# Altium schematic sheet 2_Power_Switch.SchDoc: Apalis Evaluation Board 1.1
size A3; Organization: Toradex AG; Address1: Altsagenstrasse 5; Address2: Horw; Address3: 6048; Address4: Switzerland; DocumentNumber: 4; Revision: V1.1; SheetNumber: 4; SheetTotal: 32; PageSetup: Record=PageOptions|CenterHorizontal=True|CenterVertical=True|PrintScale=0.73|XCorrection=1.00|YCorrection=1.00|PrintKind=0|BorderSize=5000000|LeftOffset=0|BottomOffset=0|Orientation=2|PaperLength=1000|PaperWidth=1000|Scale=100|PaperSource=7|PrintQuality=-4|MediaType=1|DitherType=10|PaperKind=A4|PrintScaleMode=1
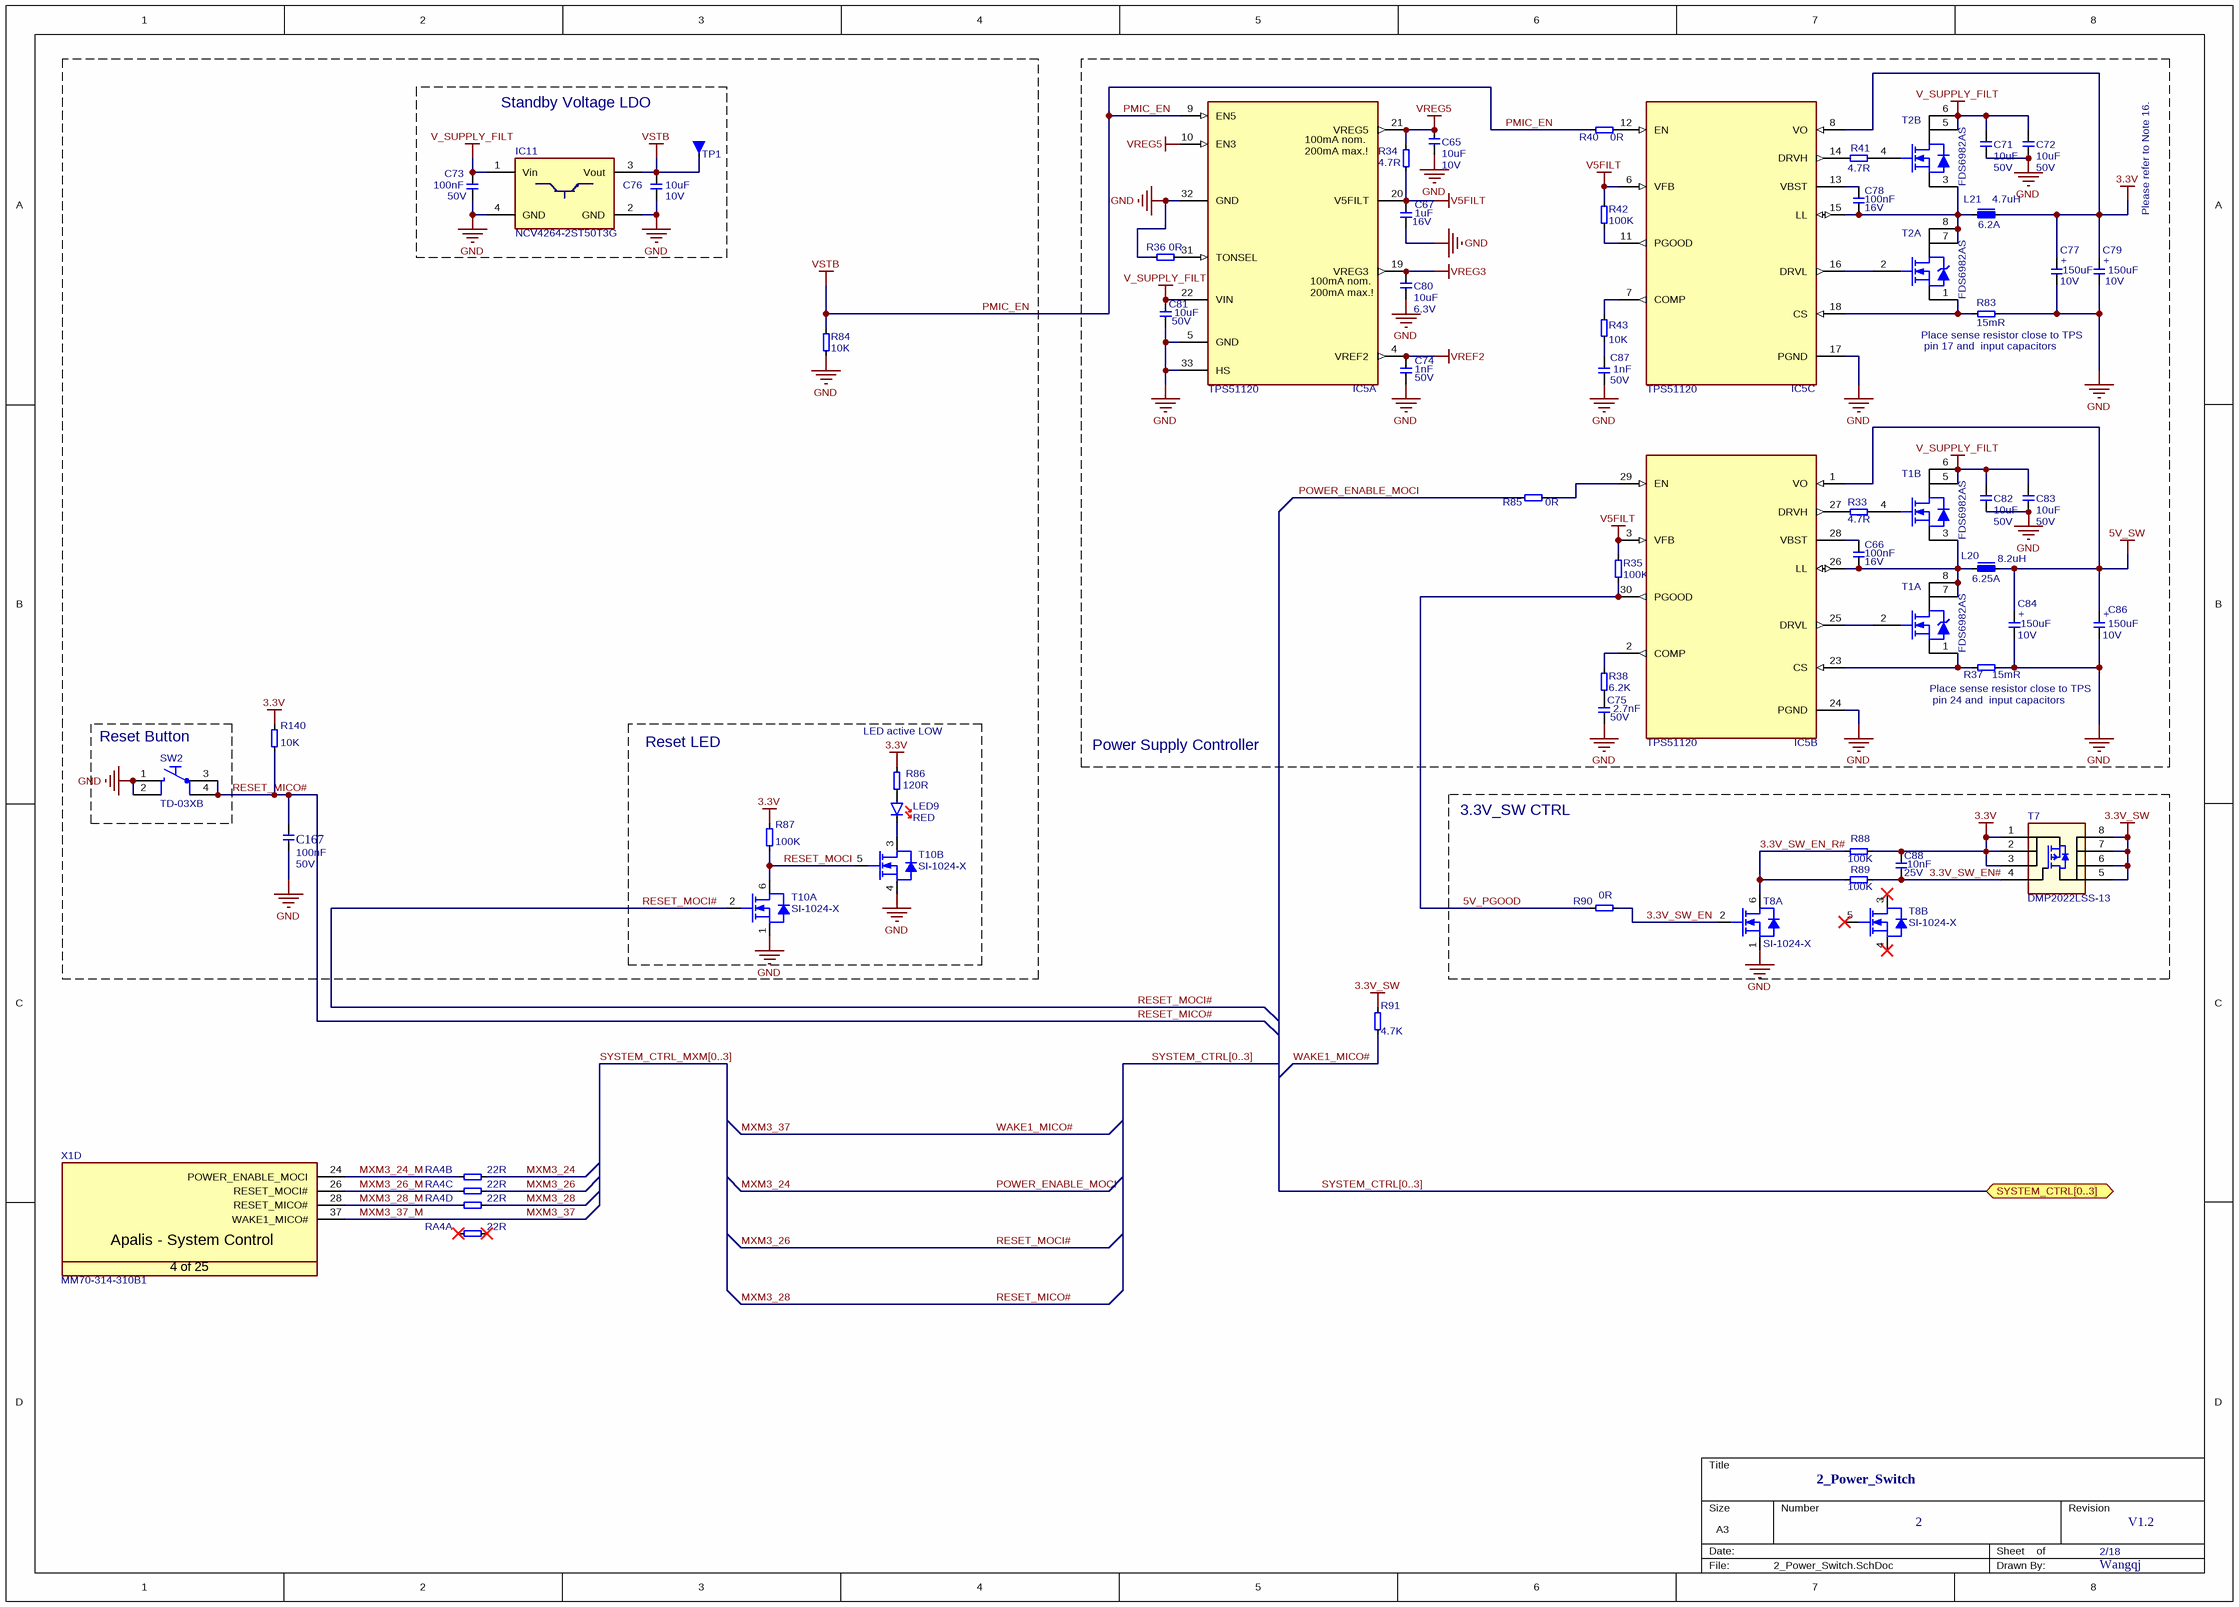
[diagram p0: 2_Power_Switch.SchDoc]

## Parts
C65  Rating: 10V  [T_CAPC0805X125N]  (hidden comment: 10uF)
C66  Rating: 16V  [T_CAPC0603X33N]  (hidden comment: 100nF)
C67  Rating: 16V  [T_CAPC0603X33N]  (hidden comment: 1uF)
C71  Rating: 50V  [CAPC3225X160N]  (hidden comment: 10uF)
C72  Rating: 50V  [CAPC3225X160N]  (hidden comment: 10uF)
C73  Rating: 50V  [T_CAPC0603X33N]  (hidden comment: 100nF)
C74  Rating: 50V  [T_CAPC0603X33N]  (hidden comment: 1nF)
C75  Rating: 50V  [CAPC1005X60N]  (hidden comment: 2.7nF)
C76  Rating: 10V  [T_CAPC0805X125N]  (hidden comment: 10uF)
C77  Rating: 10V  [CAPMP7343X310N]  (hidden comment: 150uF)
C78  Rating: 16V  [T_CAPC0603X33N]  (hidden comment: 100nF)
C79  Rating: 10V  [CAPMP7343X310N]  (hidden comment: 150uF)
C80  Rating: 6.3V  [T_CAPC0603X33N]  (hidden comment: 10uF)
C81  Rating: 50V  [CAPC3225X160N]  (hidden comment: 10uF)
C82  Rating: 50V  [CAPC3225X160N]  (hidden comment: 10uF)
C83  Rating: 50V  [CAPC3225X160N]  (hidden comment: 10uF)
C84  Rating: 10V  [CAPMP7343X310N]  (hidden comment: 150uF)
C86  Rating: 10V  [CAPMP7343X310N]  (hidden comment: 150uF)
C87  Rating: 50V  [T_CAPC0603X33N]  (hidden comment: 1nF)
C88  Rating: 25V  [T_CAPC0603X33N]  (hidden comment: 10nF)
C167  Rating: 50V  [T_CAPC0603X33N]  (hidden comment: 100nF)
IC5  TPS51120  [QFN50P500X500X100-33N]  (parts A,B,C of 3)
IC11  NCV4264-2ST50T3G  [T_ON_NCV4264-2ST50T3G]
L20  Rating: 6.25A  [T_INDM120120X80N]  (hidden comment: 8.2uH)
L21  Rating: 6.2A  [T_INDM102102X45N]  (hidden comment: 4.7uH)
LED9  Color: RED  [LC-0805_LED_S3]  (hidden comment: LS T670-K1L2-1)
R33  4.7R  [RESC1005X40N]
R34  4.7R  [RESC1005X40N]
R35  100K  [T_RESC0603X30N]
R36  0R  [T_RESC0603X30N]
R37  15mR  [RESC3316X76N]
R38  6.2K  [RESC1005X40N]
R40  0R  [T_RESC0603X30N]
R41  4.7R  [RESC1005X40N]
R42  100K  [T_RESC0603X30N]
R43  10K  [T_RESC0603X30N]
R83  15mR  [RESC3316X76N]
R84  10K  [T_RESC0603X30N]
R85  0R  [T_RESC0603X30N]
R86  120R  [T_RESC0603X30N]
R87  100K  [T_RESC0603X30N]
R88  100K  [T_RESC0603X30N]
R89  100K  [T_RESC0603X30N]
R90  0R  [T_RESC0603X30N]
R91  4.7K  [t_RESC0603X30N]
R140  10K  [0805R]
RA4  22R  [T_Resistor_Array_X4]  (parts A,B,C,D of 4)
SW2  TD-03XB  [T_WMF_TD-03XB]
T1  FDS6982AS  [SOIC127P600X173-8N]  (parts A,B of 2)
T2  FDS6982AS  [SOIC127P600X173-8N]  (parts A,B of 2)
T7  DMP2022LSS-13  [SOIC127P600X173-8N]
T8  Manufacturer Part No.: SI-1024-X  [SOTFL50P160X60-6N]  (hidden comment: T-Vishay-SI-1024X-N)  (parts A,B of 2)
T10  Manufacturer Part No.: SI-1024-X  [SOTFL50P160X60-6N]  (hidden comment: T-Vishay-SI-1024X-N)  (parts A,B of 2)
TP1  Testpin  [T_TP-THT]  (value not drawn)
X1  Manufacturer Part No.: MM70-314-310B1  [T_JAE_MM70-314-310B1]  (hidden comment: CON-JAE-MM70-314-310B1-314-0.5mm)  (part D of 25)

## Blocks framed on the sheet
LED active LOW: C167 R84 R140
Power Supply Controller: C65-C67 C71 C72 C74 C75 C77-C84 C86 C87 IC5 L20 L21 R33-R38 R40-R43 R83 R85 T1 T2
Standby Voltage LDO: C73 C76 IC11 TP1
Reset Button: SW2
Reset LED: LED9 R86 R87 T10
3.3V_SW CTRL: C88 R88-R90 T7 T8

## Ports
SYSTEM_CTRL[0..3] (bidir)

## Nets
3.3V: C77.1 C79.1 C88.2 IC5.8(VO) L21.2 R86.2 R87.2 R88.1 R140.2 T7.1(S) T7.2(S) T7.3(S)
3.3V_SW: R91.1 T7.5(D) T7.6(D) T7.7(D) T7.8(D)
5V_SW: C84.1 C86.1 IC5.1(VO) L20.2
GND: C65.1 C67.1 C71.1 C72.1 C73.1 C74.1 C75.1 C76.1 C77.2 C79.2 C80.1 C81.1 C82.1 C83.1 C84.2 C86.2 C87.1 C167.1 IC5.5(GND) IC5.17(PGND) IC5.24(PGND) IC5.32(GND) IC5.33(HS) IC11.2(GND) IC11.4(GND) R36.1 R37.2 R83.2 R84.1 SW2.1 SW2.2 T8.1(S) T10.1(S) T10.4(S)
PMIC_EN: C76.2 IC5.9(EN5) IC11.3(Vout) R40.1 R84.2 TP1.1  [also labelled VSTB]
V5FILT: C67.2 IC5.3(VFB) IC5.6(VFB) IC5.20(V5FILT) R34.1 R35.2 R42.2
V_SUPPLY_FILT: C71.2 C72.2 C73.2 C81.2 C82.2 C83.2 IC5.22(VIN) IC11.1(Vin) T1.5(D) T1.6(D) T2.5(D) T2.6(D)
VREF2: C74.2 IC5.4(VREF2)
VREG3: C80.2 IC5.19(VREG3)
VREG5: C65.2 IC5.10(EN3) IC5.21(VREG5) R34.2
3.3V_SW_EN: R90.1 T8.2(G)
3.3V_SW_EN#: C88.1 R89.1 T7.4(G)
3.3V_SW_EN_R#: R88.2 R89.2 T8.6(D)
5V_PGOOD: IC5.30(PGOOD) R35.1 R90.2
MXM3_24: R85.1 RA4.6  [also labelled POWER_ENABLE_MOCI]
MXM3_24_M: RA4.2 X1.24(POWER_ENABLE_MOCI)
MXM3_26: RA4.7 T10.2(G)  [also labelled RESET_MOCI#]
MXM3_26_M: RA4.3 X1.26(RESET_MOCI#)
MXM3_28: C167.2 R140.1 RA4.8 SW2.3 SW2.4  [also labelled RESET_MICO#]
MXM3_28_M: RA4.4 X1.28(RESET_MICO#)
MXM3_37: R91.2 X1.37(WAKE1_MICO#)  [also labelled MXM3_37_M, WAKE1_MICO#]
RESET_MOCI: R87.1 T10.5(G) T10.6(D)
NetC66_1: C66.1 IC5.26(LL) L20.1 T1.3(S) T1.7(D) T1.8(D)
NetC66_2: C66.2 IC5.28(VBST)
NetC75_2: C75.2 R38.1
NetC78_1: C78.1 IC5.15(LL) L21.1 T2.3(S) T2.7(D) T2.8(D)
NetC78_2: C78.2 IC5.13(VBST)
NetC87_2: C87.2 R43.1
NetIC5_2: IC5.2(COMP) R38.2
NetIC5_7: IC5.7(COMP) R43.2
NetIC5_11: IC5.11(PGOOD) R42.1
NetIC5_12: IC5.12(EN) R40.2
NetIC5_14: IC5.14(DRVH) R41.1
NetIC5_16: IC5.16(DRVL) T2.2(G)
NetIC5_18: IC5.18(CS) R83.1 T2.1(S)
NetIC5_23: IC5.23(CS) R37.1 T1.1(S)
NetIC5_25: IC5.25(DRVL) T1.2(G)
NetIC5_27: IC5.27(DRVH) R33.1
NetIC5_29: IC5.29(EN) R85.2
NetIC5_31: IC5.31(TONSEL) R36.2
NetLED9_A: LED9.A R86.1
NetLED9_K: LED9.K T10.3(D)
NetR33_2: R33.2 T1.4(G)
NetR41_2: R41.2 T2.4(G)

Not connected (* = marked no-connect by the designer): RA4 1* 5*; T8 3(D)* 4(S)* 5(G)*

## Buses and harness runs
bus SYSTEM_CTRL[0..3] = port SYSTEM_CTRL[0..3]
bus SYSTEM_CTRL_MXM[0..3]

## Notes on the sheet
- Please refer to Note 16.
- (near R83) Place sense resistor close to TPS
- pin 17 and  input capacitors
- (near R37) Place sense resistor close to TPS
- pin 24 and  input capacitors
- 2_Power_Switch
- 2
- 2/18
- V1.2
- Wangqj
- Title
- Size:
- Date:
- A3
- Number:
- Time:
- Revision:
- Sheet
- of
- File:
- (in symbol C-TA-150uF-10V-10%-7343) +
- (in symbol CON-JAE-MM70-314-310B1-314-0.5mm, part D) Apalis - System Control; 4 of 25
- (in symbol IC-TI-TPS51120, part A) 100mA nom.; 200mA max.!

## Library data of the parts
C65 C76 = C-X5R-10uF-10V-20%-0805: Capacitor Ceramic X5R 10uF 10V 20% 0805; Tolerance: 20%; Type: X5R; Value: 10uF
C66 C78 = C-X7R-100nF-16V-10%-0603: Capacitor Ceramic X7R 100nF 16V 10% 0603; Tolerance: 10%; Type: X7R; Value: 100nF
C67 = C-X5R-1uF-16V-20%-0603: Capacitor Ceramic X5R 1uF 16V 20% 0603; Tolerance: 20%; Type: X5R; Value: 1uF
C71 C72 C81-C83 = C-X5R-10uF-50V-20%-1210: Capacitor Ceramic X5R 10uF 50V 20% 1210; Tolerance: 20%; Type: X5R; Value: 10uF
C73 = C-X7R-100nF-50V-20%-0603: Capacitor Ceramic X7R 100nF 50V 20% 0603; Tolerance: 20%; Type: X7R; Value: 100nF
C74 C87 = C-X7R-1nF-50V-10%-0603: Capacitor Ceramic X7R 1nF 50V 10% 0603; Tolerance: 10%; Type: X7R; Value: 1nF
C75 = C-X7R-2.7nF-50V-10%-0402: Capacitor Ceramic X7R 2.7nF 50V 10% 0402; Tolerance: 10%; Type: X7R; Value: 2.7nF
C77 C79 C84 C86 = C-TA-150uF-10V-10%-7343: Capacitor TA 150uF 10V 10% 7343; Tolerance: 10%; Type: TA; Value: 150uF
C80 = C-X5R-10uF-6.3V-20%-0603: Capacitor Ceramic X5R 10uF 6.3V 20% 0603; Tolerance: 20%; Type: X5R; Value: 10uF
C88 = C-X7R-10nF-25V-10%-0603: Capacitor Ceramic X7R 10nF 25V 10% 0603; Tolerance: 10%; Type: X7R; Value: 10nF
C167 = C-100nF-50V-20%-0603-X7R: Capacitor Ceramic X7R 100nF 50V 20% 0603; Tolerance: 20%; Type: X7R; Value: 100nF
IC5 = IC-TI-TPS51120: Power Supply Controller; Manufacturer Name: Texas Instruments; Manufacturer Part No.: TPS51120
IC11 = IC-ON-NCV4264-2ST50T3G: NCV4264-2ST50T3G LDO Regulator; Manufacturer Name: ON Semiconductor; Manufacturer Part No.: NCV4264-2ST50T3G
L20 = L-Wurth-744771008-8.2uH-6.25A-20%: Inductance 8.2uH 6.25A 20%; Manufacturer Name: Wurth; Tolerance: 20%; Manufacturer Part No.: 744771008; Value: 8.2uH
L21 = L-Wurth-7447797470-4.7uH-6.2A-20%: Inductance 4.7uH 6.2A 20%; Manufacturer Name: Wurth; Tolerance: 20%; Manufacturer Part No.: 7447797470; Value: 4.7uH
LED9 = LED-Osram-LS T670-K1L2-1: LED red, Osram LS T670-K1L2-1; Manufacturer Name: Osram; Manufacturer Part No.: LS T670-K1L2-1
R33 R34 R41 = R-4.7R-63mW-5%-0402: Resistor 4.7 ohm 63mW 5% 0402; Rating: 63mW; Tolerance: 5%; Value: 4.7R
R35 R42 R87-R89 = R-100KR-63mW-5%-0603: Resistor 100 Kohm 63mW 5% 0603; Value: 100KR; Rating: 63mW; Tolerance: 5%
R36 R40 R85 R90 = R-0R-63mW-1%-0603: Resistor 0 ohm 63mW 1% 0603; Rating: 63mW; Tolerance: 1%; Value: 0R
R37 R83 = R-15mR-250mW-1%-1206: Resistor 15 mohm 250mW 1% 1206; Rating: 250mW; Tolerance: 1%; Value: 15mR
R38 = R-6.2KR-63mW-1%-0402: Resistor 6.2 Kohm 63mW 1% 0402; Value: 6.2KR; Rating: 63mW; Tolerance: 1%
R43 = R-10KR-63mW-1%-0603: Resistor 10 Kohm 63mW 1% 0603; Value: 10KR; Rating: 63mW; Tolerance: 1%
R84 = R-10KR-63mW-5%-0603: Resistor 10 Kohm 63mW 5% 0603; Value: 10KR; Rating: 63mW; Tolerance: 5%
R86 = R-120R-63mW-5%-0603: Resistor 120 ohm 63mW 5% 0603; Rating: 63mW; Tolerance: 5%; Value: 120R
R91 = R-4.7kR-63mW-5%-0603: Resistor 4.7 Kohm 63mW 5% 0603; Value: 4.7KR; Rating: 63mW; Tolerance: 5%
R140 = R-100KR-63mW-5%-0603: Resistor 100 Kohm 63mW 5% 0603; Value: 10KR; Rating: 63mW; Tolerance: 5%
RA4 = RA-22R-63mW-5%-1206-div: Resistor Array 22 R 63mW 5% 1206; Tolerance: 5%; Power Dissipation: 63mW; Value: 22R
SW2 = SW-WMF-TD-03XB: Push Button; Manufacturer Name: WMF; Rating: 50mA; Manufacturer Part No.: TD-03XB
T1 T2 = T-Fairchild-FDS6982AS-N: N-Channel PowerTrench SyncFET; Manufacturer Name: Fairchild; Manufacturer Part No.: FDS6982AS
T7 = T-Diodes-DMP2022LSS-13-8-SOIC: p-channel MOSFET, DMP2022LSS-13; Manufacturer Name: DIODES; Manufacturer Part No.: DMP2022LSS-13
T8 T10 = T-Vishay-SI-1024X-N: Dual N-Channel 20V (D-S)  MOSFET; Manufacturer Name: Vishay
TP1 = Testpin: Testpin TH
X1 = CON-JAE-MM70-314-310B1-314-0.5mm: MXM3 Connector; Manufacturer Name: JAE; No. of ways: 314